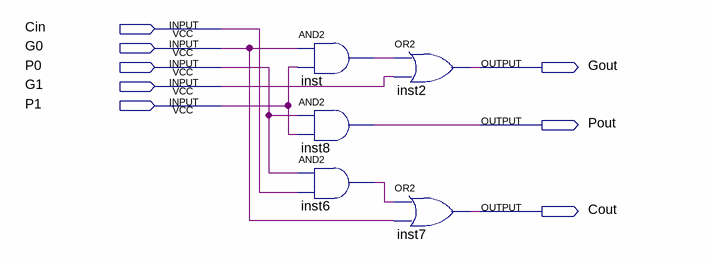
[diagram p0: schematic sheet]
// Quartus schematic 2bit_BCLA.bdf as structural Verilog: 5 symbols, 8 pins
module \2bit_BCLA  (
  input  Cin,
  input  G0,
  input  P0,
  input  G1,
  input  P1,
  output Gout,
  output Pout,
  output Cout
);

  wire inst6_out, inst_out;

  and inst (inst_out, G0, P1);
  and inst8 (Pout, P0, P1);
  and inst6 (inst6_out, P0, Cin);
  or inst2 (Gout, inst_out, G1);
  or inst7 (Cout, inst6_out, G0);
endmodule
